# Altium schematic sheet input2.SchDoc
size A4
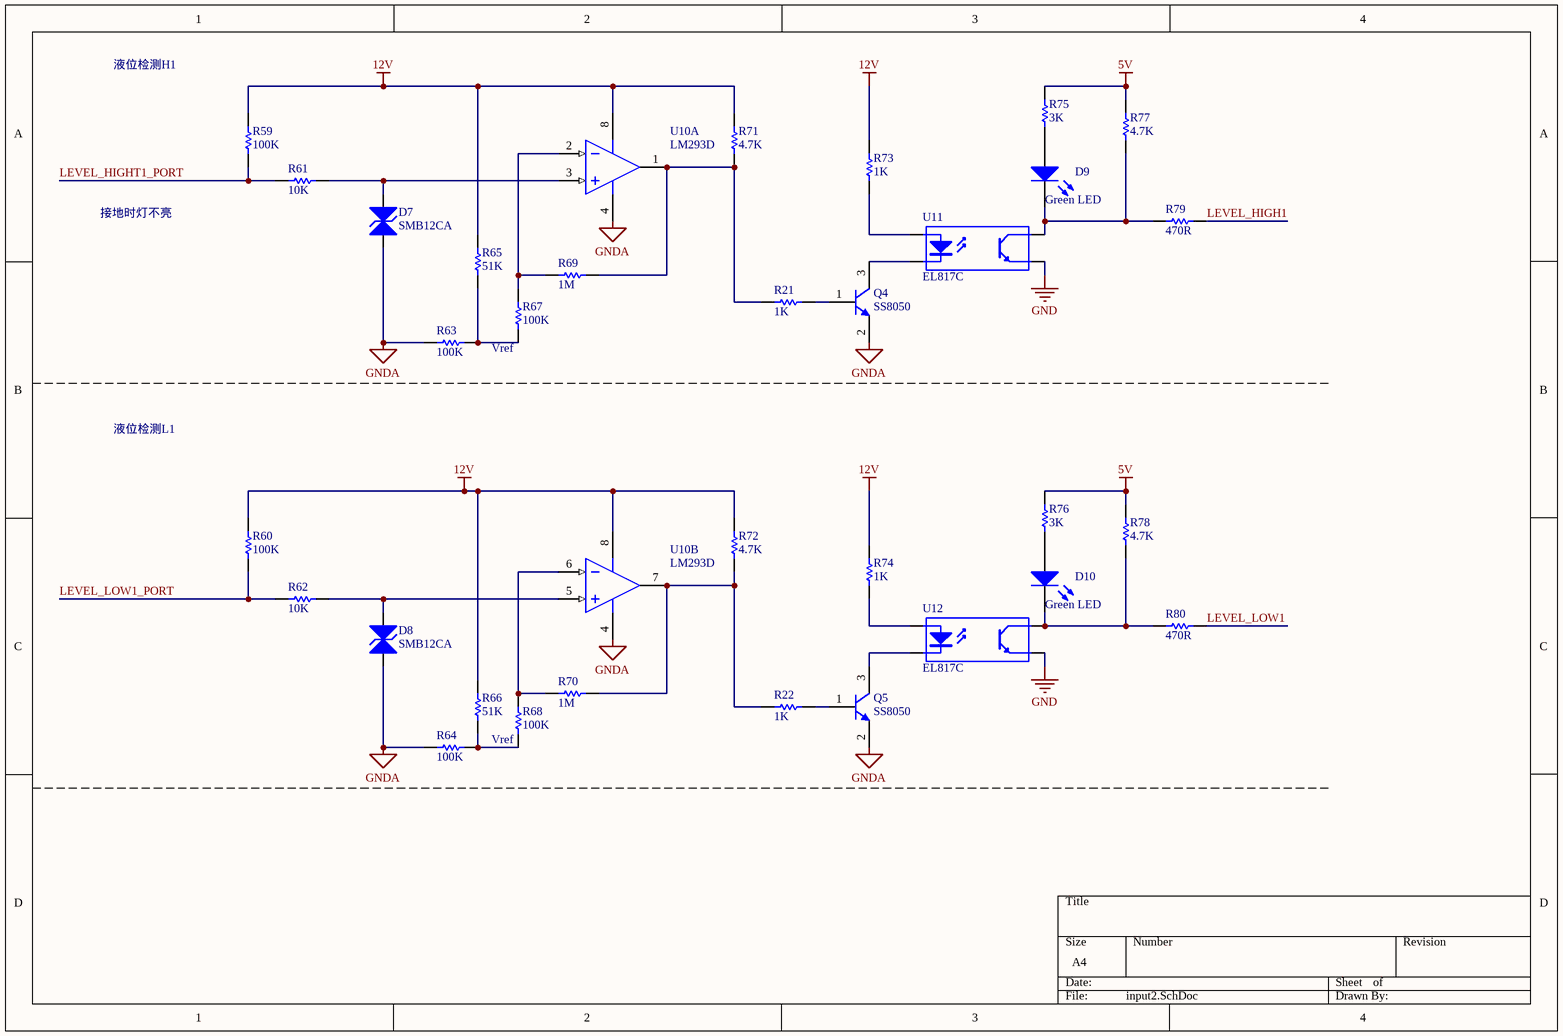
[diagram p0: input2.SchDoc]

## Parts
D7  SMB12CA  [SMB]
D8  SMB12CA  [SMB]
D9  Green LED  [LED254A]
D10  Green LED  [LED254A]
Q4  SS8050  [SOT-23_N]
Q5  SS8050  [SOT-23_N]
R21  1K  [RESC2012M]
R22  1K  [RESC2012M]
R59  100K  [RESC2012M]
R60  100K  [RESC2012M]
R61  10K  [RESC2012M]
R62  10K  [RESC2012M]
R63  100K  [RESC2012M]
R64  100K  [RESC2012M]
R65  51K  [RESC2012M]
R66  51K  [RESC2012M]
R67  100K  [RESC2012M]
R68  100K  [RESC2012M]
R69  1M  [RESC2012M]
R70  1M  [RESC2012M]
R71  4.7K  [RESC2012M]
R72  4.7K  [RESC2012M]
R73  1K  [RESC2012M]
R74  1K  [RESC2012M]
R75  3K  [RESC2012M]
R76  3K  [RESC2012M]
R77  4.7K  [RESC2012M]
R78  4.7K  [RESC2012M]
R79  470R  [RESC2012M]
R80  470R  [RESC2012M]
U10  LM293D  [SO8_N]  (parts A,B of 2)
U11  EL817C  [SO-4LA]
U12  EL817C  [SO-4LA]

## Nets
5V: R75.1 R76.1 R77.2 R78.2
12V: R59.2 R60.2 R65.2 R66.2 R71.1 R72.2 R73.2 R74.1 U10.8(V+)
GND: U11.3(E) U12.3(E)
GNDA: D7.1(A) D8.1(A) Q4.2(E) Q5.2(E) R63.1 R64.1 U10.4(V-)
LEVEL_HIGH1: R79.2
LEVEL_HIGHT1_PORT: R59.1 R61.2
LEVEL_LOW1: R80.2
LEVEL_LOW1_PORT: R60.1 R62.2
NetD7_2: D7.2(K) R61.1 U10.3(IN+)
NetD8_2: D8.2(K) R62.1 U10.5(IN+)
NetD9_1: D9.1(A) R75.2
NetD9_2: D9.2(K) R77.1 R79.1 U11.4(C)
NetD10_1: D10.1(A) R76.2
NetD10_2: D10.2(K) R78.1 R80.1 U12.4(C)
NetQ4_1: Q4.1(B) R21.2
NetQ4_3: Q4.3(C) U11.2(K)
NetQ5_1: Q5.1(B) R22.2
NetQ5_3: Q5.3(C) U12.2(K)
NetR21_1: R21.1 R69.2 R71.2 U10.1(OUT)
NetR22_1: R22.1 R70.2 R72.1 U10.7(OUT)
NetR63_2: R63.2 R65.1 R67.2
NetR64_2: R64.2 R66.1 R68.1
NetR67_1: R67.1 R69.1 U10.2(IN-)
NetR68_2: R68.2 R70.1 U10.6(IN-)
NetR73_1: R73.1 U11.1(A)
NetR74_2: R74.2 U12.1(A)

## Notes on the sheet
- 液位检测H1
- 接地时灯不亮
- (near R67) Vref
- 液位检测L1
- (near R68) Vref

## Library data of the parts
D7 D8 = Bi-dir TVS Diode: Published: 8-Jun-2000; LatestRevisionDate: 17-Jul-2002; LatestRevisionNote: Re-released for DXP Platform.; PackageReference: DIODE-0.7; Publisher: Altium Limited
D9 D10 = LED1: Green LED ,SIP, Dia =3mm; Published: 8-Jun-2000; LatestRevisionDate: 08-Jul-2005; LatestRevisionNote: Mech Layer 1 removed.; PackageReference: LED-1; Publisher: Altium Limited
Q4 Q5 = PMMT491A: NPN BISS Transistor; Published: 17-Sep-2003; LatestRevisionDate: 12-Dec-2006; LatestRevisionNote: IPC-7351 Footprint Added.; DatasheetVersion: 11-Jun-2001; PackageVersion: May-1999; PackageReference: SOT23; Publisher: Altium Limited; PackageDescription: 3-Pin SOT-23 Package 0.95 mm Pitch, 2.3 mm Lead Span; ComponentLink1Description: Manufacturer Link; ComponentLink1URL: http://www.semiconductors.philips.com/; ComponentLink2Description: Datasheet; ComponentLink2URL: http://www.semiconductors.philips.com/acrobat/datasheets/PMMT491A_5.pdf
R21 R22 R59 R60 R63-R80 = Res1: Resistor; Value: 10K; Published: 8-Jun-2000; LatestRevisionDate: 17-Jul-2002; LatestRevisionNote: Re-released for DXP Platform.; PackageReference: AXIAL-0.3; Publisher: Altium Limited
R61 R62 = Res1: Resistor; Published: 8-Jun-2000; LatestRevisionDate: 17-Jul-2002; LatestRevisionNote: Re-released for DXP Platform.; PackageReference: AXIAL-0.3; Publisher: Altium Limited; Value: 10K
U10 = LM393AD: Low-Power Dual Voltage Comparator; Published: 24-Aug-2001; LatestRevisionDate: 13-Apr-2006; LatestRevisionNote: IPC-7351 Footprint Added.; DatasheetVersion: Nov-1992; PackageVersion: Dec-2002; PackageReference: SO8; Publisher: Altium Limited; PackageDescription: 8-Pin Small Outline Integrated Circuit 1.27 mm Pitch; Code_JEDEC: MS-012-AA; Code_IPC: SOIC127P600-8; ComponentLink1Description: Manufacturer Link; ComponentLink1URL: http://www.st.com/; ComponentLink2Description: Datasheet; ComponentLink2URL: http://www.st.com/stonline/products/literature/ds/2164/lm193.pdf
U11 U12 = Optoisolator1: 4-Pin Phototransistor Optocoupler; Published: 24-Mar-1999; LatestRevisionDate: 04-Mar-2005; LatestRevisionNote: Sch pins 3 & 4 Swapped.; DatasheetVersion: Nov-2003; PackageReference: DIP-4; Publisher: Altium Limited